# Altium schematic sheet 15 AUX SDIO CONN, CAN.SchDoc
size 513 x 386 mm
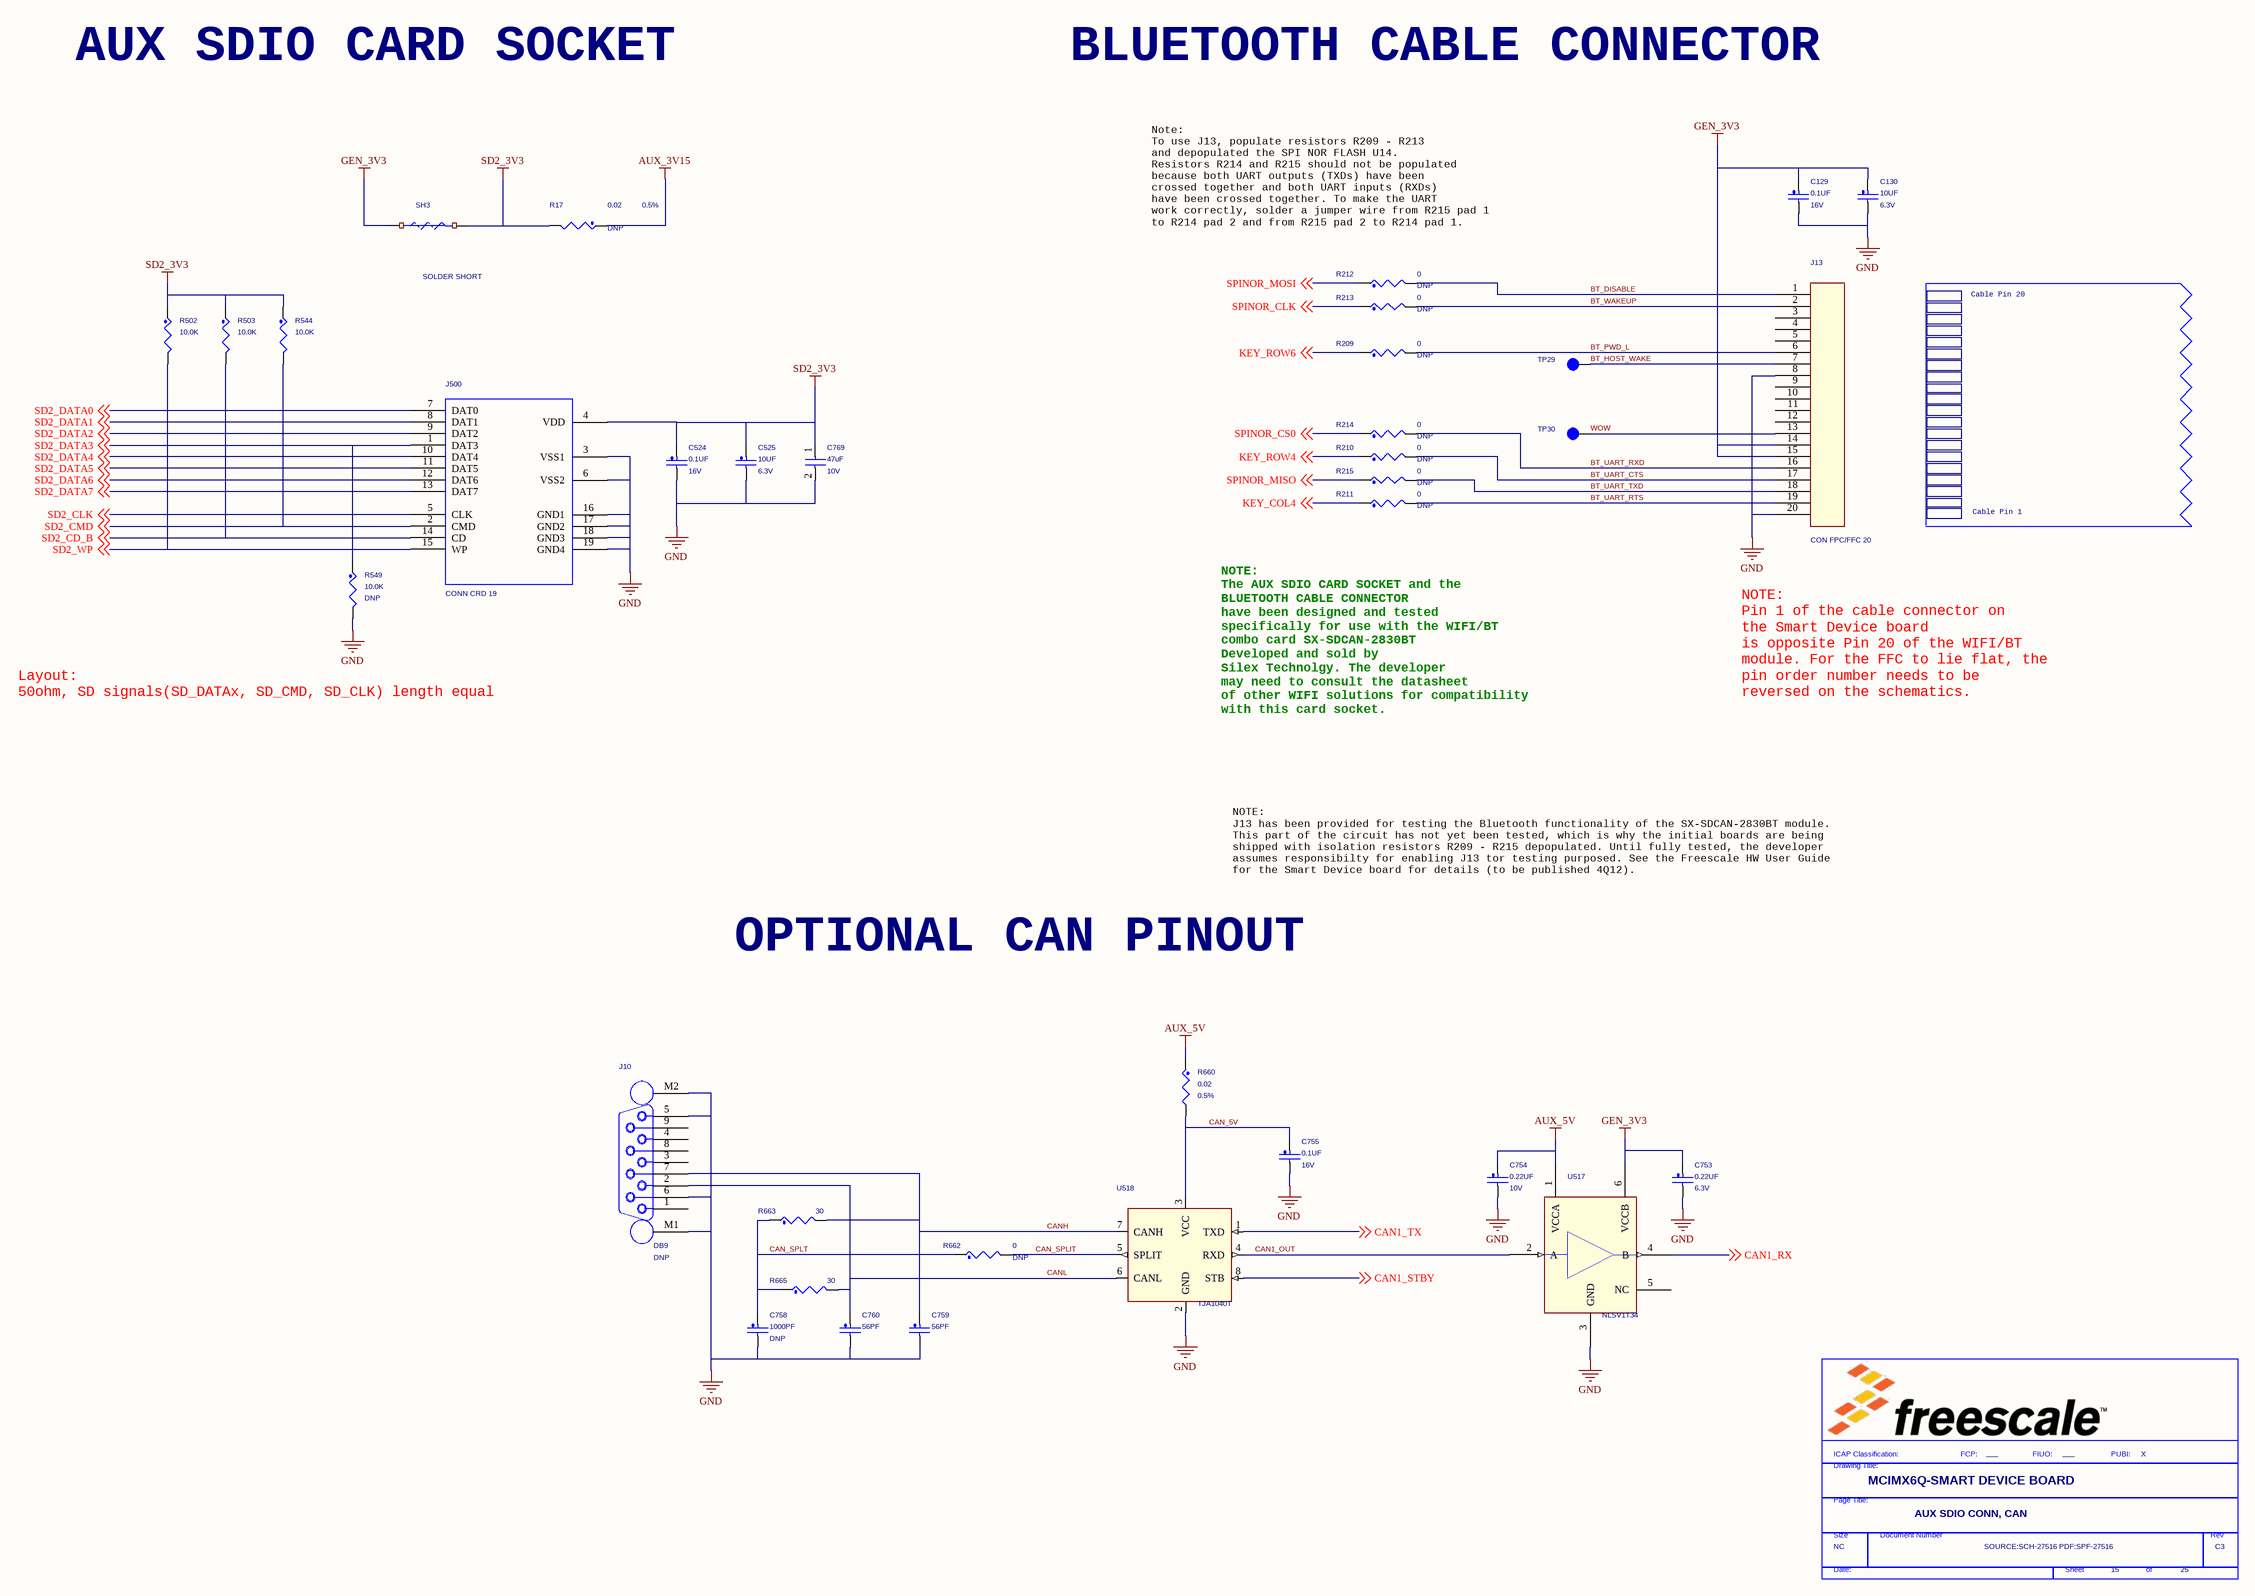
[diagram p0: 15 AUX SDIO CONN, CAN.SchDoc]

## Parts
*  FIUO: ___  PUBI: X  Doc: SOURCE:SCH-27516 PDF:SPF-27516  RevCode: C3  Title: MCIMX6Q-SMART DEVICE BOARD  Page Size: NC  Page Number: 15  Page Count: 25  PageTitle: AUX SDIO CONN, CAN  (hidden comment: TitleBlock_FS)  (graphical)
C129  0.1UF  VOLTAGE: 16V  [0402_CC]
C130  10UF  VOLTAGE: 6.3V  [0603_CC]
C524  0.1UF  VOLTAGE: 16V  [0402_CC]
C525  10UF  VOLTAGE: 6.3V  [0603_CC]
C753  0.22UF  WVDC: 6.3V  [0201_CC]
C754  0.22UF  WVDC: 10V  [0201_CC]
C755  0.1UF  WVDC: 16V  [0402_CC]
C758  1000PF  ASSY_OPT: DNP  [0402_CC]
C759  56PF  [0201_CC]
C760  56PF  [0201_CC]
C769  47uF  WVDC: 10V  [1206_CC]
J10  DB9  ASSY_OPT: DNP  [con_db_9f_2p74_th]
J13  CON FPC/FFC 20  [con20_fh28_sm]
J500  CONN CRD 19  [con19_sdcard_28x16_sm]
R17  0.02  ASSY_OPT: DNP  Tolerance: 0.5%  [0805_CC]
R209  0  ASSY_OPT: DNP  [0402_CC]
R210  0  ASSY_OPT: DNP  [0402_CC]
R211  0  ASSY_OPT: DNP  [0402_CC]
R212  0  ASSY_OPT: DNP  [0402_CC]
R213  0  ASSY_OPT: DNP  [0402_CC]
R214  0  ASSY_OPT: DNP  [0402_CC]
R215  0  ASSY_OPT: DNP  [0402_CC]
R502  10.0K  [0402_CC]
R503  10.0K  [0402_CC]
R544  10.0K  [0402_CC]
R549  10.0K  ASSY_OPT: DNP  [0402_CC]
R660  0.02  Tolerance: 0.5%  [0805_CC]
R662  0  ASSY_OPT: DNP  [0402_CC]
R663  30  [0402_CC]
R665  30  [0402_CC]
SH3  SOLDER SHORT  [SH0805_40]
TP29  tpad_020  [tpad_020]  (value not drawn)
TP30  tpad_020  [tpad_020]  (value not drawn)
U517  NLSV1T34  [ullga6_1p45x1_0p5mm]
U518  TJA1040T  [SO8_1P27_4X5]

## Nets
AUX_3V15: R17.1
AUX_5V: C754.1 R660.1 U517.1(VCCA)
GEN_3V3: C129.1 C130.1 C753.1 J13.14 J13.15 SH3.1 U517.6(VCCB)
GND: C129.2 C130.2 C524.2 C525.2 C753.2 C754.2 C755.2 C758.2 C759.2 C760.2 C769.2 J10.5 J10.6 J10.M1 J10.M2 J13.8 J13.20 J500.3(VSS1) J500.6(VSS2) J500.16(GND1) J500.17(GND2) J500.18(GND3) J500.19(GND4) R549.2 U517.3(GND) U518.2(GND)
SD2_3V3: C524.1 C525.1 C769.1 J500.4(VDD) R17.2 R502.1 R503.1 R544.1 SH3.2
BT_DISABLE: J13.1 R212.2
BT_HOST_WAKE: J13.7 TP29.1(Pin1)
BT_PWD_L: J13.6 R209.2
BT_UART_CTS: J13.17 R210.2
BT_UART_RTS: J13.19 R211.2
BT_UART_RXD: J13.16 R214.2
BT_UART_TXD: J13.18 R215.2
BT_WAKEUP: J13.2 R213.2
CAN1_OUT: U517.2(A) U518.4(RXD)
CAN1_RX: U517.4(B) ; off-sheet CAN1_RX
CAN1_STBY: U518.8(STB) ; off-sheet CAN1_STBY
CAN1_TX: U518.1(TXD) ; off-sheet CAN1_TX
CAN_5V: C755.1 R660.2 U518.3(VCC)
CAN_SPLIT: R662.2 U518.5(SPLIT)
CAN_SPLT: C758.1 R662.1 R663.1 R665.1
CANH: C759.1 J10.7 R663.2 U518.7(CANH)
CANL: C760.1 J10.2 R665.2 U518.6(CANL)
KEY_COL4: R211.1 ; off-sheet KEY_COL4
KEY_ROW4: R210.1 ; off-sheet KEY_ROW4
KEY_ROW6: R209.1 ; off-sheet KEY_ROW6
SD2_CD_B: J500.14(CD) R503.2 ; off-sheet SD2_CD_B
SD2_CLK: J500.5(CLK) ; off-sheet SD2_CLK
SD2_CMD: J500.2(CMD) R544.2 ; off-sheet SD2_CMD
SD2_DATA0: J500.7(DAT0) ; off-sheet SD2_DATA0
SD2_DATA1: J500.8(DAT1) ; off-sheet SD2_DATA1
SD2_DATA2: J500.9(DAT2) ; off-sheet SD2_DATA2
SD2_DATA3: J500.1(DAT3) R549.1 ; off-sheet SD2_DATA3
SD2_DATA4: J500.10(DAT4) ; off-sheet SD2_DATA4
SD2_DATA5: J500.11(DAT5) ; off-sheet SD2_DATA5
SD2_DATA6: J500.12(DAT6) ; off-sheet SD2_DATA6
SD2_DATA7: J500.13(DAT7) ; off-sheet SD2_DATA7
SD2_WP: J500.15(WP) R502.2 ; off-sheet SD2_WP
SPINOR_CLK: R213.1 ; off-sheet SPINOR_CLK
SPINOR_CS0: R214.1 ; off-sheet SPINOR_CS0
SPINOR_MISO: R215.1 ; off-sheet SPINOR_MISO
SPINOR_MOSI: R212.1 ; off-sheet SPINOR_MOSI
WOW: J13.13 TP30.1(Pin1)

Not connected (* = marked no-connect by the designer): J10 1 3 4 8 9; J13 3 4 5 9 10 11 12; U517 5(NC)

## Notes on the sheet
- AUX SDIO CARD SOCKET
- BLUETOOTH CABLE CONNECTOR
- (near R212) Note:
  To use J13, populate resistors R209 - R213
  and depopulated the SPI NOR FLASH U14.
  Resistors R214 and R215 should not be populated
  because both UART outputs (TXDs) have been
  crossed together and both UART inputs (RXDs)
  have been crossed together. To make the UART
  work correctly, solder a jumper wire from R215 pad 1
  to R214 pad 2 and from R215 pad 2 to R214 pad 1.
- Cable Pin 20
- Cable Pin 1
- NOTE:
  The AUX SDIO CARD SOCKET and the
  BLUETOOTH CABLE CONNECTOR
  have been designed and tested
  specifically for use with the WIFI/BT
  combo card SX-SDCAN-2830BT
  Developed and sold by
  Silex Technolgy. The developer
  may need to consult the datasheet
  of other WIFI solutions for compatibility
  with this card socket.
- NOTE:
  Pin 1 of the cable connector on
  the Smart Device board
  is opposite Pin 20 of the WIFI/BT
  module. For the FFC to lie flat, the
  pin order number needs to be
  reversed on the schematics.
- Layout:
  50ohm, SD signals(SD_DATAx, SD_CMD, SD_CLK) length equal
- NOTE:
  J13 has been provided for testing the Bluetooth functionality of the SX-SDCAN-2830BT module.
  This part of the circuit has not yet been tested, which is why the initial boards are being
  shipped with isolation resistors R209 - R215 depopulated. Until fully tested, the developer
  assumes responsibilty for enabling J13 tor testing purposed. See the Freescale HW User Guide
  for the Smart Device board for details (to be published 4Q12).
- OPTIONAL CAN PINOUT
- (in symbol TitleBlock_FS) ICAP Classification:; FCP:; FIUO:; PUBI:; Drawing Title:; Page Title:; Size; Document Number; Rev; Date:; Sheet; of

## Library data of the parts
* = TitleBlock_FS: OrgName: Freescale Semiconductor; OrgAddr1: 6501 William Cannon Drive West; OrgAddr2: Austin, TX 78735-8598; FCP: ___; Page Create Date: March  8, 1995
C129 = CAP_NP: CAP CER 0.1UF 16V 10% X7R 0402; CLASS: DISCRETE; SIGNAL_MODEL: DEFAULT_CAPACITOR_100000pF_2_1; AGILE_PN: 150-75182; MFG_NAME01: KEMET; MFG_PN01: C0402C104K4RAC; CAD_APPROVED: Yes; FPLIST: CC0402_25,CC0402_HD,0402_CC; Tolerance: 10%; ROHS: Yes; HEIGHT: 0.635MM
C130 = CAP_NP: CAP CER 10UF 6.3V 10% X5R 0603; CLASS: DISCRETE; SIGNAL_MODEL: DEFAULT_CAPACITOR_1e+07pF_2_1; AGILE_PN: 150-77832; MFG_NAME01: TDK; MFG_PN01: C1608X5R0J106KT; CAD_APPROVED: Yes; FPLIST: CC0603_OV,CC0603,0603_CC; Tolerance: 10%; ROHS: Yes; HEIGHT: 1.0MM
C524 = CAP_NP: CAP CER 0.1UF 16V 10% X7R 0402; CLASS: DISCRETE; FPLIST: CC0402_25,CC0402_HD,0402_CC; CAD_APPROVED: Yes; MFG_PN01: C0402C104K4RAC; MFG_NAME01: KEMET; AGILE_PN: 150-75182; SIGNAL_MODEL: DEFAULT_CAPACITOR_100000pF_2_1; HEIGHT: 0.635MM; ROHS: Yes; Tolerance: 10%
C525 = CAP_NP: CAP CER 10UF 6.3V 10% X5R 0603; CLASS: DISCRETE; FPLIST: CC0603_OV,CC0603,0603_CC; CAD_APPROVED: Yes; MFG_PN01: C1608X5R0J106KT; MFG_NAME01: TDK; AGILE_PN: 150-77832; SIGNAL_MODEL: DEFAULT_CAPACITOR_1e+07pF_2_1; HEIGHT: 1.0MM; ROHS: Yes; Tolerance: 10%
C753 = CAP_NP: CAP CER 0.22UF 6.3V 20% X5R 0201; CLASS: DISCRETE; PRIORITY_PN: 021-00278; FPLIST: CC0201,CC0201_HD,0201_CC,cc_0201_cir; CAD_APPROVED: Yes; MFG_PN01: JMK063BJ224MP-F; MFG_NAME01: TAIYO YUDEN; AGILE_PN: 150-77852; ROOM: CPU; SIGNAL_MODEL: DEFAULT_CAPACITOR_220000pF_2_1; VOLTAGE: 6.3V; HEIGHT: 0.33 MM; ROHS: Yes; Tolerance: 20%
C754 = CAP_NP: CAP CER 0.22UF 10V 20% X5R 0201; CLASS: DISCRETE; ROOM: CPU; AGILE_PN: 150-78815; MFG_NAME01: Taiyo Yuden; MFG_PN01: LMK063BJ224MP-F; CAD_APPROVED: Yes; FPLIST: CC0201,CC0201_HD,0201_CC,CC_0201_CIR,0201_CC_012SM; PRIORITY_PN: 021-00278; SIGNAL_MODEL: DEFAULT_CAPACITOR_220000pF_2_1; VOLTAGE: 10V; Tolerance: 20%; ROHS: Yes; HEIGHT: 0.33MM
C755 = CAP_NP: CAP CER 0.1UF 16V 10% X7R 0402; CLASS: DISCRETE; AGILE_PN: 150-75182; MFG_NAME01: KEMET; MFG_PN01: C0402C104K4RAC; CAD_APPROVED: Yes; FPLIST: CC0402_25,CC0402_HD,0402_CC; SIGNAL_MODEL: DEFAULT_CAPACITOR_100000pF_2_1; VOLTAGE: 16V; Tolerance: 10%; ROHS: Yes; HEIGHT: 0.635MM
C758 = CAP_NP: CAP CER 1000PF 50V 5% C0G 0402; CLASS: DISCRETE; FPLIST: CC0402_25,CC0402_HD,0402_CC; CAD_APPROVED: Yes; MFG_PN01: C0402C0G500-102JNP; MFG_NAME01: VENKEL COMPANY; AGILE_PN: 150-75591; SIGNAL_MODEL: DEFAULT_CAPACITOR_1000pF_2_1; HEIGHT: 0.635MM; ROHS: Yes
C759 C760 = CAP_NP: CAP CER 56PF 25V 5% C0G CC0201; CLASS: DISCRETE; FPLIST: CC0201,CC0201_HD,0201_CC; CAD_APPROVED: Yes; MFG_PN01: GRM0335C1E560JD01D; MFG_NAME01: MURATA; AGILE_PN: 150-76810; SIGNAL_MODEL: DEFAULT_CAPACITOR_56pF_2_1; VOLTAGE: 25V; HEIGHT: 0.33MM; ROHS: Yes; Tolerance: 5%
C769 = MOT_CAP: CAP CER 47uF 10V 20% X5R 1206; CLASS: DISCRETE; SIGNAL_MODEL: DEFAULT_CAPACITOR_4.7e+07pF_2_1; AGILE_PN: 150-78578; MFG_NAME01: TAIYO YUDEN; MFG_PN01: LMK316BJ476ML-T; CAD_APPROVED: Yes; FPLIST: CC1206_OV,CC1206,1206_CC; VOLTAGE: 10V; Tolerance: 20%; ROHS: Yes; HEIGHT: 1.80MM
J10 = CONN_DB9F_MTGTABS: CON 9 DB -- SKT TH 54MIL SP 479H AU; CLASS: IO; CAD_APPROVED: Yes; MFG_PN01: 5207826-4; MFG_NAME01: TYCO ELECTRONICS; AGILE_PN: 210-77856; HEIGHT: 12.55MM; ROHS: Yes
J13 = CON20_1: CON 1X20 FPC/FFC RA SKT SMT 0.5MM SP 100H AU; CLASS: IO; AGILE_PN: 211-78733; MFG_NAME01: HIROSE; MFG_PN01: FH28E-20S-0.5SH(05); CAD_APPROVED: Yes; ROHS: Yes; HEIGHT: 5.4MM
J500 = CONN_SDC013_19P: CON 19 CRD SKT SMT -- 150H AU; CLASS: IO; AGILE_PN: 211-76801; MFG_NAME01: PROCONN TECHNOLOGY CO., LTD; MFG_PN01: SDC013-A0-501F; CAD_APPROVED: Yes; ROHS: Yes; HEIGHT: 3.80 MM
R17 = RES: RES MF 0.02OHM 1/4W 0.5% 0805; CLASS: DISCRETE; PRIORITY_PN: 006-00742; FPLIST: RC0805_OV,RC0805,0805_CC; CAD_APPROVED: Yes; MFG_PN01: WSL0805R0200DEA18; MFG_NAME01: VISHAY INTERTECHNOLOGY; AGILE_PN: 470-79241; SIGNAL_MODEL: DEFAULT_RESISTOR_0.02OHM_2_1; ROHS: Yes
R209 R211 R214 R215 = RES: RES MF ZERO OHM 1/10W -- 0402; CLASS: DISCRETE; FPLIST: RC0402_25,RC0402_HD,RC0402_X2,0402_CC; CAD_APPROVED: Yes; MFG_PN01: ERJ-2GE0R00X; MFG_NAME01: Panasonic; AGILE_PN: 470-79965; SIGNAL_MODEL: DEFAULT_RESISTOR_0.001OHM_2_1; ROHS: Yes
R210 R212 R213 = RES: RES MF ZERO OHM 1/10W -- 0402; CLASS: DISCRETE; SIGNAL_MODEL: DEFAULT_RESISTOR_0.001OHM_2_1; AGILE_PN: 470-79965; MFG_NAME01: Panasonic; MFG_PN01: ERJ-2GE0R00X; CAD_APPROVED: Yes; FPLIST: RC0402_25,RC0402_HD,RC0402_X2,0402_CC; ROHS: Yes
R502 R503 R544 = RES: RES MF 10.0K 1/16W 1% 0402; CLASS: DISCRETE; SIGNAL_MODEL: DEFAULT_RESISTOR_10000OHM_2_1; FPLIST: RC0402_25,RC0402_HD,0402_CC; CAD_APPROVED: Yes; MFG_PN01: CRCW040210K0FKED; MFG_NAME01: VISHAY INTERTECHNOLOGY; AGILE_PN: 470-75416; ROHS: Yes; Tolerance: 1%
R549 = RES: RES MF 10.0K 1/16W 1% 0402; CLASS: DISCRETE; SIGNAL_MODEL: DEFAULT_RESISTOR_10000OHM_2_1; AGILE_PN: 470-75416; MFG_NAME01: VISHAY INTERTECHNOLOGY; MFG_PN01: CRCW040210K0FKED; CAD_APPROVED: Yes; FPLIST: RC0402_25,RC0402_HD,0402_CC; Tolerance: 1%; ROHS: Yes
R660 = RES: RES MF 0.02OHM 1/4W 0.5% 0805; CLASS: DISCRETE; AGILE_PN: 470-79241; MFG_NAME01: VISHAY INTERTECHNOLOGY; MFG_PN01: WSL0805R0200DEA18; CAD_APPROVED: Yes; FPLIST: RC0805_OV,RC0805,0805_CC; SIGNAL_MODEL: DEFAULT_RESISTOR_0.02OHM_2_1; ROHS: Yes
R662 = RES: RES MF ZERO OHM 1/16W 5% 0402; CLASS: DISCRETE; AGILE_PN: 470-75394; MFG_NAME01: ROHM; MFG_PN01: MCR01MZPJ000; CAD_APPROVED: Yes; FPLIST: RC0402_25,RC0402_HD,RC0402_X2,0402_CC; SIGNAL_MODEL: DEFAULT_RESISTOR_0.001OHM_2_1; Tolerance: 5%; ROHS: Yes
R663 = RES: RES MF 30 OHM 1/16W 1% 0402; CLASS: DISCRETE; AGILE_PN: 470-30688; MFG_NAME01: KOA SPEER; MFG_PN01: RK73H1ETTP30R0F; CAD_APPROVED: Yes; FPLIST: RC0402_25,RC0402_HD,0402_CC; SIGNAL_MODEL: DEFAULT_RESISTOR_30OHM_2_1; Tolerance: 1%; ROHS: Yes
R665 = RES: RES MF 30 OHM 1/16W 1% 0402; CLASS: DISCRETE; FPLIST: RC0402_25,RC0402_HD,0402_CC; CAD_APPROVED: Yes; MFG_PN01: RK73H1ETTP30R0F; MFG_NAME01: KOA SPEER; AGILE_PN: 470-30688; SIGNAL_MODEL: DEFAULT_RESISTOR_30OHM_2_1; ROHS: Yes; Tolerance: 1%
SH3 = RES_SHORT-2: SOLDER SHORT 0805  SMT NO PART TO ORDER; CLASS: DISCRETE; FPLIST: SH0805,SH0805CUST,SH0805_40; CAD_APPROVED: Yes; ASSY_OPT: DNP; MFG_PN01: SOLDER_SHORT_0805; MFG_NAME01: NOTACOMPONENT; AGILE_PN: 470-80202; ROHS: Yes
TP29 TP30 = TESTLOOP: TEST POINT PAD 0.5MM DIA SMT, NO PART TO ORDER; CLASS: IO; AGILE_PN: 211-77484; ASSY_OPT: DNP; CAD_APPROVED: Yes; ROHS: Yes; HEIGHT: 0.1MM
U517 = NLSV1T34: IC VXLTR 1 BIT DUAL-SUPPLY 0.9-4.5V 613AF; AGILE_PN: 312-79552; MFG_NAME01: On Semiconductor; MFG_PN01: NLSV1T34AMX1TCG; CAD_APPROVED: Yes; CLASS: IC; ROHS: Yes; HEIGHT: 0.4MM
U518 = TJA1040T_SO_8P: IC XCVR CAN HS 5V SO8; CAD_APPROVED: Yes; MFG_NAME01: NXP SEMICONDUCTORS; AGILE_PN: 312-79676; CLASS: IC; HEIGHT: 1.75 MM; ROHS: Yes; MFG_PN01: TJA1040T